# Altium schematic sheet STLINK.SchDoc
size A4
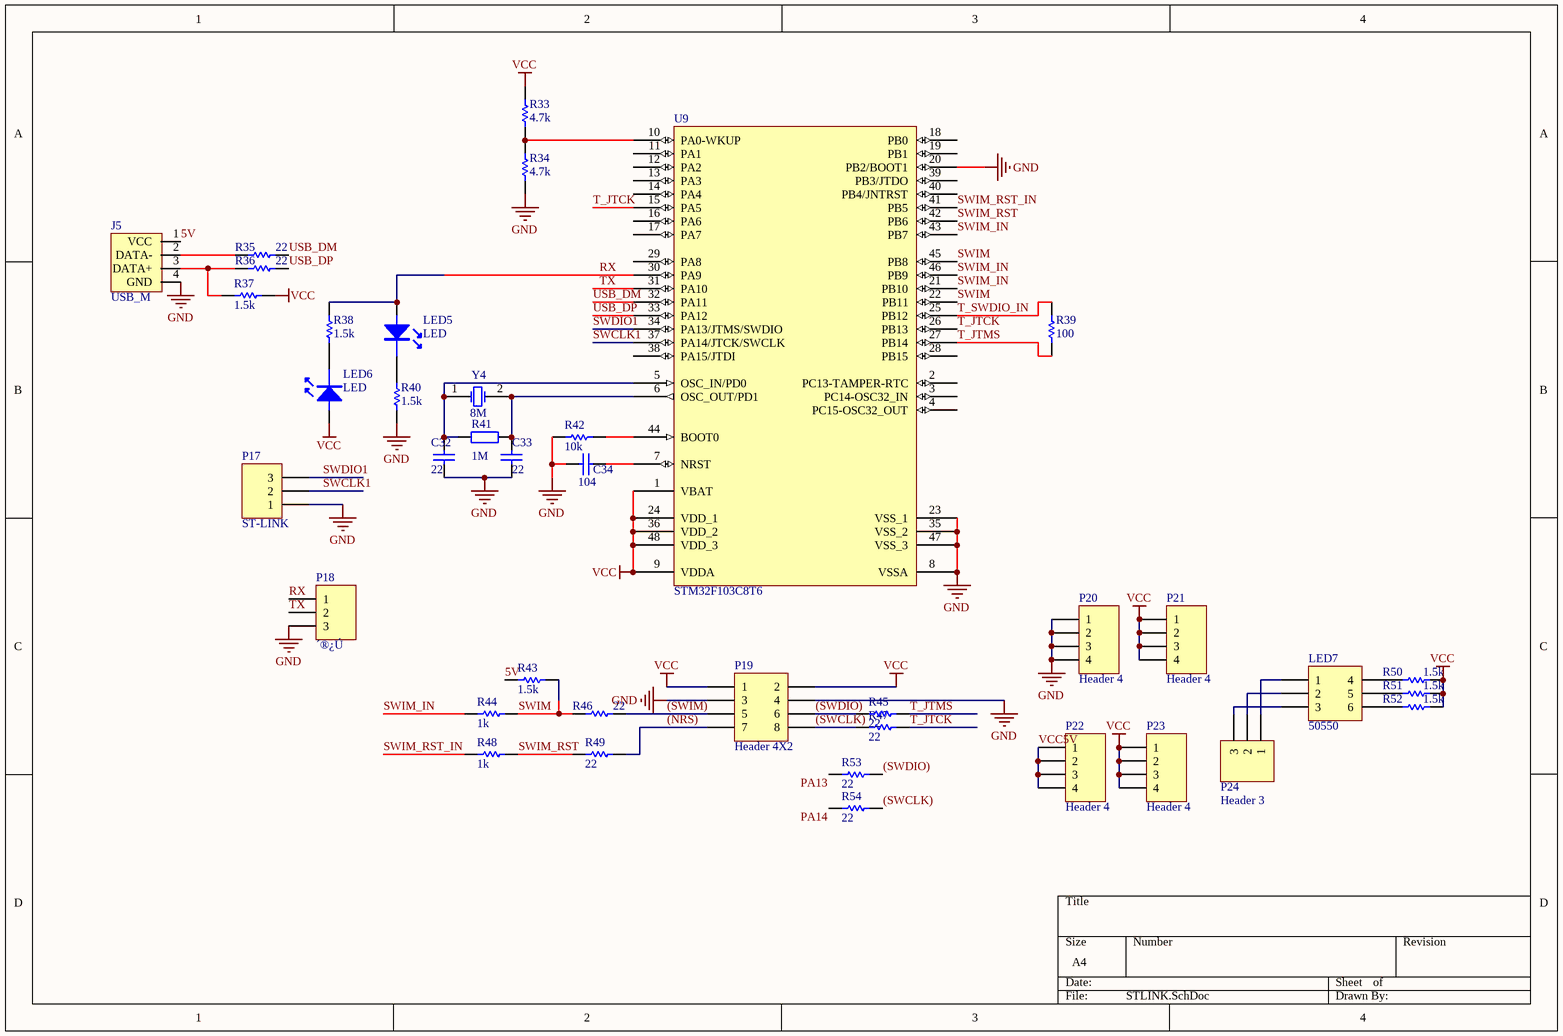
[diagram p0: STLINK.SchDoc]

## Parts
C32  value 22  [6-0805_N]  (hidden comment: Cap)
C33  value 22  [6-0805_N]  (hidden comment: Cap)
C34  value 104  [6-0805_N]  (hidden comment: Cap)
J5  USB_M  [USB MICRO]
LED5  LED  [6-0805_N]
LED6  LED  [6-0805_N]
LED7  50550  [led5050]
P17  ST-LINK  [HDR1X3]
P18  ´®¿Ú  [HDR1X3]
P19  Header 4X2  [HDR2X4]
P20  Header 4  [HDR1X4]
P21  Header 4  [HDR1X4]
P22  Header 4  [HDR1X4]
P23  Header 4  [HDR1X4]
P24  Header 3  [HDR1X3]
R33  value 4.7k  [6-0805_N]  (hidden comment: RES)
R34  value 4.7k  [6-0805_N]  (hidden comment: RES)
R35  value 22  [6-0805_N]  (hidden comment: RES)
R36  value 22  [6-0805_N]  (hidden comment: RES)
R37  value 1.5k  [6-0805_N]  (hidden comment: RES)
R38  value 1.5k  [6-0805_N]  (hidden comment: RES)
R39  value 100  [6-0805_N]  (hidden comment: RES)
R40  value 1.5k  [6-0805_N]  (hidden comment: RES)
R41  value 1M  [6-0805_N]  (hidden comment: Res2)
R42  value 10k  [6-0805_N]  (hidden comment: RES)
R43  value 1.5k  [6-0805_N]  (hidden comment: RES)
R44  value 1k  [6-0805_N]  (hidden comment: RES)
R45  value 22  [6-0805_N]  (hidden comment: RES)
R46  value 22  [6-0805_N]  (hidden comment: RES)
R47  value 22  [6-0805_N]  (hidden comment: RES)
R48  value 1k  [6-0805_N]  (hidden comment: RES)
R49  value 22  [6-0805_N]  (hidden comment: RES)
R50  value 1.5k  [6-0805_N]  (hidden comment: RES)
R51  value 1.5k  [6-0805_N]  (hidden comment: RES)
R52  value 1.5k  [6-0805_N]  (hidden comment: RES)
R53  value 22  [1608[0603]]  (hidden comment: RES)
R54  value 22  [1608[0603]]  (hidden comment: RES)
U9  STM32F103C8T6  [LQFP48S]
Y4  8M  [¾§Õñ]

## Nets
GND: C32.1 C33.1 C34.1 J5.4(GND) P17.1 P18.3 P19.3 P19.4 P20.1 P20.2 P20.3 P20.4 R34.1 R40.1 R42.1 U9.8(VSSA) U9.20(PB2/BOOT1) U9.23(VSS_1) U9.35(VSS_2) U9.47(VSS_3)
VCC: LED6.1(A) P19.1 P19.2 P21.1 P21.2 P21.3 P21.4 P23.1 P23.2 P23.3 P23.4 R33.2 R37.2 R50.1 R51.1 R52.1 U9.1(VBAT) U9.9(VDDA) U9.24(VDD_1) U9.36(VDD_2) U9.48(VDD_3)
5V: J5.1(VCC) R43.1
(NRS): P19.7 R49.1
(SWCLK): P19.8 R47.1 R54.2
(SWDIO): P19.6 R45.1 R53.2
(SWIM): P19.5 R46.1
PA13: R53.1
PA14: R54.1
RX: LED5.1(A) P18.1 R38.2 U9.30(PA9)
SWCLK1: P17.2 U9.37(PA14/JTCK/SWCLK)
SWDIO1: P17.3 U9.34(PA13/JTMS/SWDIO)
SWIM: R43.2 R44.2 R46.2 U9.22(PB11) U9.45(PB8)
SWIM_IN: R44.1 U9.21(PB10) U9.43(PB7) U9.46(PB9)
SWIM_RST: R48.2 R49.2 U9.42(PB6)
SWIM_RST_IN: R48.1 U9.41(PB5)
T_JTCK: R47.2 U9.15(PA5) U9.26(PB13)
T_JTMS: R39.1 R45.2 U9.27(PB14)
T_SWDIO_IN: R39.2 U9.25(PB12)
TX: P18.2 U9.31(PA10)
USB_DM: R35.2 U9.32(PA11)
USB_DP: R36.2 U9.33(PA12)
VCC5V: P22.1 P22.2 P22.3 P22.4
NetC32_2: C32.2 R41.1 U9.5(OSC_IN/PD0) Y4.1(OSC1)
NetC33_2: C33.2 R41.2 U9.6(OSC_OUT/PD1) Y4.2(OSC2)
NetC34_2: C34.2 U9.7(NRST)
NetJ5_2: J5.2(DATA-) R35.1
NetJ5_3: J5.3(DATA+) R36.1 R37.1
NetLED5_2: LED5.2(K) R40.2
NetLED6_2: LED6.2(K) R38.1
NetLED7_1: LED7.1 P24.1
NetLED7_2: LED7.2 P24.2
NetLED7_3: LED7.3 P24.3
NetLED7_4: LED7.4 R50.2
NetLED7_5: LED7.5 R51.2
NetLED7_6: LED7.6 R52.2
NetR33_1: R33.1 R34.2 U9.10(PA0-WKUP)
NetR42_2: R42.2 U9.44(BOOT0)

Not connected (* = marked no-connect by the designer): U9 2(PC13-TAMPER-RTC) 3(PC14-OSC32_IN) 4(PC15-OSC32_OUT) 11(PA1) 12(PA2) 13(PA3) 14(PA4) 16(PA6) 17(PA7) 18(PB0) 19(PB1) 28(PB15) 29(PA8) 38(PA15/JTDI) 39(PB3/JTDO) 40(PB4/JNTRST)

## Library data of the parts
C32 C33 = Cap: Capacitor; Published: 8-Jun-2000; LatestRevisionDate: 17-Jul-2002; LatestRevisionNote: Re-released for DXP Platform.; PackageReference: RAD-0.3; Publisher: Altium Limited; PackageDescription: Radial Cap, Thru-Hole; 2 Leads; 0.3 in Pin Spacing
LED7 = Header 3X2A: Header, 3-Pin, Dual row; LatestRevisionDate: 17-Jul-2002; LatestRevisionNote: Re-released for DXP Platform.; Publisher: Altium Limited
P17 P18 P24 = Header 3: Header, 3-Pin; LatestRevisionDate: 17-Jul-2002; LatestRevisionNote: Re-released for DXP Platform.; Publisher: Altium Limited
P19 = Header 4X2: Header, 4-Pin, Dual row; LatestRevisionDate: 17-Jul-2002; LatestRevisionNote: Re-released for DXP Platform.; Publisher: Altium Limited
P20-P23 = Header 4: Header, 4-Pin; LatestRevisionDate: 17-Jul-2002; LatestRevisionNote: Re-released for DXP Platform.; Publisher: Altium Limited
R41 = Res2: Resistor; Published: 8-Jun-2000; LatestRevisionDate: 17-Jul-2002; LatestRevisionNote: Re-released for DXP Platform.; PackageReference: AXIAL-0.4; Publisher: Altium Limited; PackageDescription: Axial Device, Thru-Hole; 2 Leads; 0.4 in Pin Spacing
U9 = STM32F103C8T6: STM32 ARM-based 32-bit MCU with 64 Kbytes Flash, 48-pin LQFP, Industrial Temperature; Published: 30-May-2008; DatasheetVersion: rev6, Mar-2008; PackageVersion: Mar-2008; PackageReference: LQFP48; Publisher: Altium Limited; PackageDescription: 48-Pin Low-Profile Quad Flat Pack, 7 x 7 mm Body, 0.5 mm Pitch (LQFP48); ComponentLink1Description: Manufacturer Link; ComponentLink1URL: www.st.com/stm32; ComponentLink2Description: Datasheet; ComponentLink2URL: http://www.st.com/stonline/products/literature/ds/13587.pdf
Y4 = ¾§Õñ